# Altium schematic sheet Integrated_Main_Driver_Board-04-Debug & Communication Circuit-20230110.SchDoc
size A4
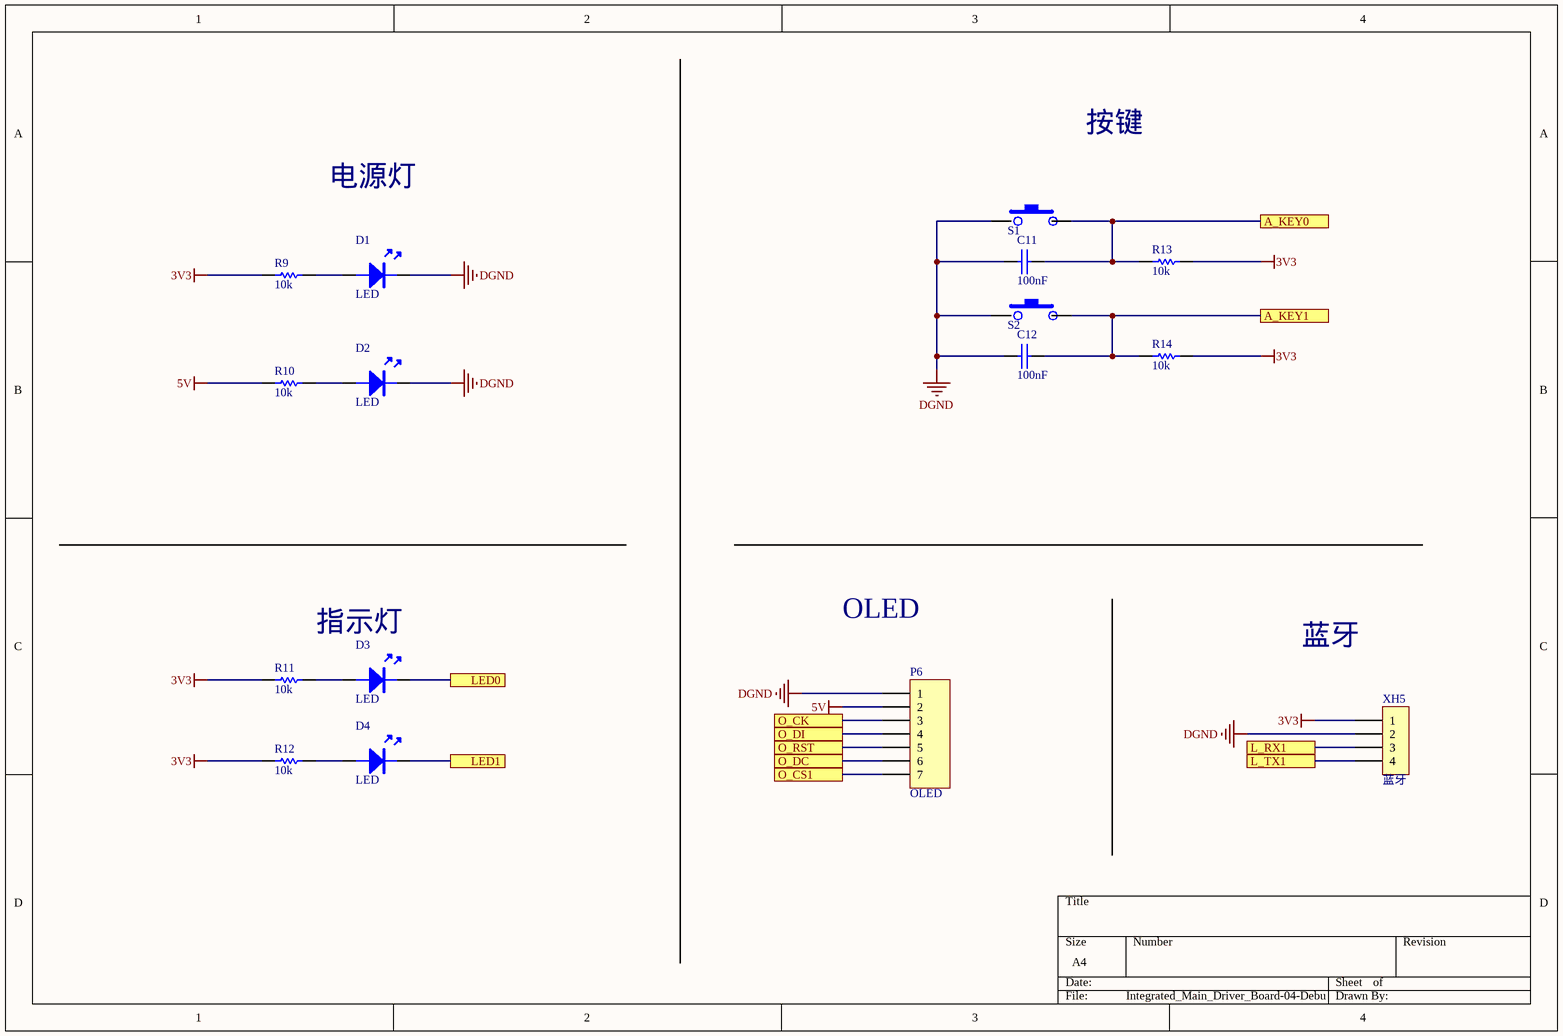
[diagram p0: Integrated_Main_Driver_Board-04-Debug & Communication Circuit-20230110.SchDoc]

## Parts
C11  100nF  [0402C]
C12  100nF  [0402C]
D1  LED  [LED-0603B]
D2  LED  [LED-0603B]
D3  LED  [LED-0603B]
D4  LED  [LED-0603B]
P6  OLED  [HDR1X7]
R9  10k  [0402R]
R10  10k  [0402R]
R11  10k  [0402R]
R12  10k  [0402R]
R13  10k  [0402R]
R14  10k  [0402R]
S1  轻触开关（3*6*2.5mm）  [轻触开关（3*6*2.5mm）]  (value not drawn)
S2  轻触开关（3*6*2.5mm）  [轻触开关（3*6*2.5mm）]  (value not drawn)
XH5  蓝牙  [XH4/2.54mm/180]

## Ports
A_KEY0, A_KEY1, L_RX1, L_TX1, LED0, LED1, O_CK, O_CS1, O_DC, O_DI, O_RST

## Nets
3V3: R9.1 R11.1 R12.1 R13.2 R14.2 XH5.1
5V: P6.2 R10.1
DGND: C11.2 C12.2 D1.K D2.K P6.1 S1.1 S2.1 XH5.2
A_KEY0: C11.1 R13.1 S1.2 ; port A_KEY0
A_KEY1: C12.1 R14.1 S2.2 ; port A_KEY1
L_RX1: XH5.3 ; port L_RX1
L_TX1: XH5.4 ; port L_TX1
LED0: D3.K ; port LED0
LED1: D4.K ; port LED1
O_CK: P6.3 ; port O_CK
O_CS1: P6.7 ; port O_CS1
O_DC: P6.6 ; port O_DC
O_DI: P6.4 ; port O_DI
O_RST: P6.5 ; port O_RST
NetD1_A: D1.A R9.2
NetD2_A: D2.A R10.2
NetD3_A: D3.A R11.2
NetD4_A: D4.A R12.2

## Notes on the sheet
- 按键
- 电源灯
- 指示灯
- OLED
- 蓝牙

## Library data of the parts
C11 C12 = CAP
P6 = Header 7: Header, 7-Pin; LatestRevisionDate: 17-Jul-2002; LatestRevisionNote: Re-released for DXP Platform.; Publisher: Altium Limited
R9-R14 = RES
S1 S2 = 轻触开关 3*6*2.5mm
XH5 = XH4